# Altium schematic sheet connectors.SchDoc
size A4
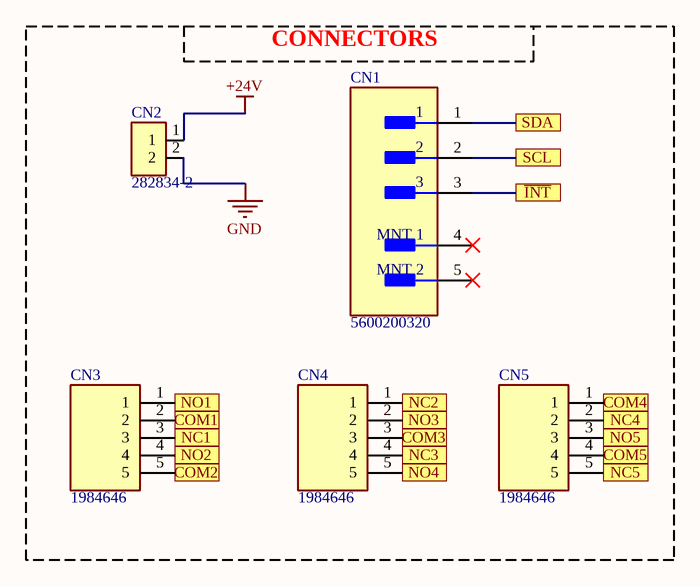
[diagram p0: connectors.SchDoc]

## Parts
CN1  5600200320  [5600200320]
CN2  282834-2  [282834-2]
CN3  1984646  [1984646]
CN4  1984646  [1984646]
CN5  1984646  [1984646]

## Ports
COM1, COM2, COM3, COM4, COM5, NC1, NC2, NC3, NC4, NC5, NO1, NO2, NO3, NO4, NO5, SCL, SDA, ~{INT}

## Nets
+24V: CN2.1
GND: CN2.2
COM1: CN3.2 ; port COM1
COM2: CN3.5 ; port COM2
COM3: CN4.3 ; port COM3
COM4: CN5.1 ; port COM4
COM5: CN5.4 ; port COM5
~{INT}: CN1.3 ; port ~{INT}
NC1: CN3.3 ; port NC1
NC2: CN4.1 ; port NC2
NC3: CN4.4 ; port NC3
NC4: CN5.2 ; port NC4
NC5: CN5.5 ; port NC5
NO1: CN3.1 ; port NO1
NO2: CN3.4 ; port NO2
NO3: CN4.2 ; port NO3
NO4: CN4.5 ; port NO4
NO5: CN5.3 ; port NO5
SCL: CN1.2 ; port SCL
SDA: CN1.1 ; port SDA

Not connected (* = marked no-connect by the designer): CN1 4(MNT_1)* 5(MNT_2)*

## Notes on the sheet
- CONNECTORS

## Library data of the parts
CN1 = 5600200320: 2.0mmDuraClik Wire-to-Board Header, Single Row, Vertical, 3 Circuits, Tin (Sn) Over Nickel, Natural; Manufacturer: Molex; Supplier 1: Digi-Key; Manufacturer Part Number: 5600200320; RoHS: Yes; Category: Headers and Wire Housings; Stock 1: 33175; Pricing 1: 1=0,92000, 10=0,75900, 100=0,63250 (USD); ComponentLink1URL: http://www.farnell.com/datasheets/2214714.pdf?src-supplier=Farnell; ComponentLink1Description: http://www.farnell.com/datasheets/2214714.pdf?src-supplier=Farnell; ComponentLink2URL: http://www.literature.molex.com/SQLImages/kelmscott/Molex/PDF_Images/987650-8742.PDF?src-supplier=Digi-Key; ComponentLink2Description: http://www.literature.molex.com/SQLImages/kelmscott/Molex/PDF_Images/987650-8742.PDF?src-supplier=Digi-Key; ComponentLink3URL: http://www.molex.com/pdm_docs/sd/5600200320_sd.pdf?src-supplier=Avnet; ComponentLink3Description: http://www.molex.com/pdm_docs/sd/5600200320_sd.pdf?src-supplier=Avnet; ComponentLink4URL: http://www.farnell.com/datasheets/2214714.pdf?src-supplier=Newark; ComponentLink4Description: http://www.farnell.com/datasheets/2214714.pdf?src-supplier=Newark; Supplier Part Number 1: WM10863CT-ND
CN2 = 282834-2: Conn Terminal Block 2 POS 2.54mm Solder ST Thru-Hole 10A/Contact; Manufacturer: TE Connectivity; Supplier 1: Digi-Key; Manufacturer Part Number: 282834-2; RoHS: Yes; Category: Terminal Blocks; Stock 1: 28181; Pricing 1: 1=1,45000, 10=1,01900, 25=0,95080, 50=0,86300, 100=0,85910, 250=0,72548, 500=0,68728, 1000=0,61092, 5000=0,57274 (USD); ComponentLink1URL: https://datasheet.ciiva.com/11758/0900766b80e7dc96-11758675.pdf?src-supplier=RSComponents; ComponentLink1Description: https://datasheet.ciiva.com/11758/0900766b80e7dc96-11758675.pdf?src-supplier=RSComponents; ComponentLink2URL: https://datasheet.ciiva.com/16386/282834-2-16386363.pdf?src-supplier=Future+Electronics; ComponentLink2Description: https://datasheet.ciiva.com/16386/282834-2-16386363.pdf?src-supplier=Future+Electronics; ComponentLink3URL: https://datasheet.ciiva.com/16676/eng-cs-1308389-eurostyle-terminal-blocks-0607-16676126.pdf?src-supplier=Avnet+Europe; ComponentLink3Description: https://datasheet.ciiva.com/16676/eng-cs-1308389-eurostyle-terminal-blocks-0607-16676126.pdf?src-supplier=Avnet+Europe; ComponentLink4URL: https://datasheet.ciiva.com/823/eng-cd-282834-c1-823453.pdf?src-supplier=Digi-Key; ComponentLink4Description: https://datasheet.ciiva.com/823/eng-cd-282834-c1-823453.pdf?src-supplier=Digi-Key; ComponentLink5URL: https://datasheet.ciiva.com/15169/getdatasheetpartid-155864-15169558.pdf?src-supplier=Verical; ComponentLink5Description: https://datasheet.ciiva.com/15169/getdatasheetpartid-155864-15169558.pdf?src-supplier=Verical; ComponentLink6URL: https://datasheet.ciiva.com/3141/eng-cs-1308389-eurostyle-terminal-blocks-0607-3141115.pdf?src-supplier=Avnet; ComponentLink6Description: https://datasheet.ciiva.com/3141/eng-cs-1308389-eurostyle-terminal-blocks-0607-3141115.pdf?src-supplier=Avnet; ComponentLink7URL: https://datasheet.ciiva.com/30166/eng-cs-1308389-eurostyle-terminal-blocks-0607-30166974.pdf?src-supplier=Onlinecomponents.com; ComponentLink7Description: https://datasheet.ciiva.com/30166/eng-cs-1308389-eurostyle-terminal-blocks-0607-30166974.pdf?src-supplier=Onlinecomponents.com; ComponentLink8URL: https://datasheet.ciiva.com/14609/70086732-14609670.pdf?src-supplier=Allied+Electronics; ComponentLink8Description: https://datasheet.ciiva.com/14609/70086732-14609670.pdf?src-supplier=Allied+Electronics; Supplier Part Number 1: A98333-ND
CN3-CN5 = 1984646: Terminal Block, Printed Circuit, 10 A, 160 V, 3.5 mm, 5, 3.5 mm, 1.2 mm, M2, PA; Manufacturer: Phoenix Contact; Number of Positions: 5; Voltage: 300V; Gender: Male; Current Rating: 17.5A; Voltage Rating: 160V; Number of Levels: 1; Current: 10A; Pitch: 3.5mm; Stripping Length: 5mm; Wire Gauge (Max): 26AWG; Approvals: UL; Supplier 1: Digi-Key; Manufacturer Part Number: 1984646; RoHS: Yes; Category: Terminal Blocks; Stock 1: 1070; Pricing 1: 1=1,25000, 10=1,19900, 50=1,16640, 100=1,09000, 250=1,03768 (USD); Mount: Through Hole; Number of Pins: 5; Contact Material: Tin; Material: Polyamide; Housing Material: Nylon; Color: Green; Weight: 0.080425oz; Housing Color: Green; Insulation Material: Nylon; Packaging: Bulk; Termination: Screw; Number of Contacts: 5; Package Quantity: 100; Number of Positions Per Level: 5; Number of Circuits: 5; Number of Rows: 1; Orientation: Straight; Max Current Rating: 17.5A; Number of Poles: 5; Length: 7.6mm; Width: 17.5mm; Height: 9mm; Depth: 9.2mm; Wire Gauge (Min): 26AWG; Lead Free: Lead Free; Flammability Rating: UL94 V-0; ComponentLink1URL: https://datasheet.ciiva.com/16070/1984646-16070645.pdf?src-supplier=Onlinecomponents.com; ComponentLink1Description: https://datasheet.ciiva.com/16070/1984646-16070645.pdf?src-supplier=Onlinecomponents.com; ComponentLink2URL: https://datasheet.ciiva.com/14608/70055018-14608827.pdf?src-supplier=Allied+Electronics; ComponentLink2Description: https://datasheet.ciiva.com/14608/70055018-14608827.pdf?src-supplier=Allied+Electronics; ComponentLink3URL: https://datasheet.ciiva.com/824/combiconcompactseries-824269.pdf?src-supplier=Digi-Key; ComponentLink3Description: https://datasheet.ciiva.com/824/combiconcompactseries-824269.pdf?src-supplier=Digi-Key; ComponentLink4URL: https://datasheet.ciiva.com/29221/568532-da-01-en-leiterplatten-anschlusskl-1984646-100st-29221147.pdf?src-supplier=Conrad; ComponentLink4Description: https://datasheet.ciiva.com/29221/568532-da-01-en-leiterplatten-anschlusskl-1984646-100st-29221147.pdf?src-supplier=Conrad; Supplier Part Number 1: 277-1723-ND